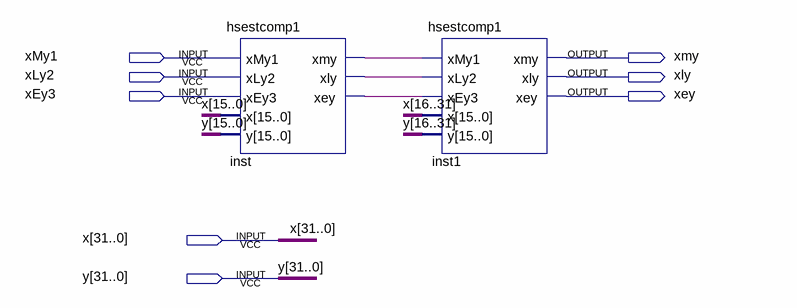
[diagram p0: schematic sheet]
// Quartus schematic tronecomp1.bdf as structural Verilog: 2 symbols, 8 pins
module tronecomp1 (
  input  xMy1,
  input  xLy2,
  input  xEy3,
  input  [31:0] x,
  input  [31:0] y,
  output xmy,
  output xly,
  output xey
);

  wire inst_xey, inst_xly, inst_xmy;

  hsestcomp1 inst (
    .xMy1(xMy1), .xLy2(xLy2), .xEy3(xEy3), .x(x[15:0]), .y(y[15:0]), .xmy(inst_xmy), .xly(inst_xly),
    .xey(inst_xey));
  hsestcomp1 inst1 (
    .xMy1(inst_xmy), .xLy2(inst_xly), .xEy3(inst_xey),
    .x({x[16], x[17], x[18], x[19], x[20], x[21], x[22], x[23], x[24], x[25], x[26], x[27], x[28], x[29], x[30], x[31]}),
    .y({y[16], y[17], y[18], y[19], y[20], y[21], y[22], y[23], y[24], y[25], y[26], y[27], y[28], y[29], y[30], y[31]}),
    .xmy(xmy), .xly(xly), .xey(xey));
endmodule
